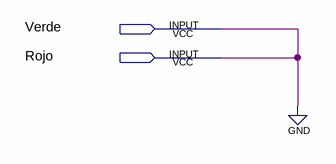
[diagram p0: schematic sheet]
// Quartus schematic Tp2Grupo3_Peatonal.bdf as structural Verilog: 0 symbols, 2 pins
module Tp2Grupo3_Peatonal (
  input  Verde,
  input  Rojo
);


  assign Verde = Rojo;
  // also tied to GND on the sheet: Rojo
endmodule
